# EAGLE design OSO-RING-A1-00 (EAGLE 9.6.2)
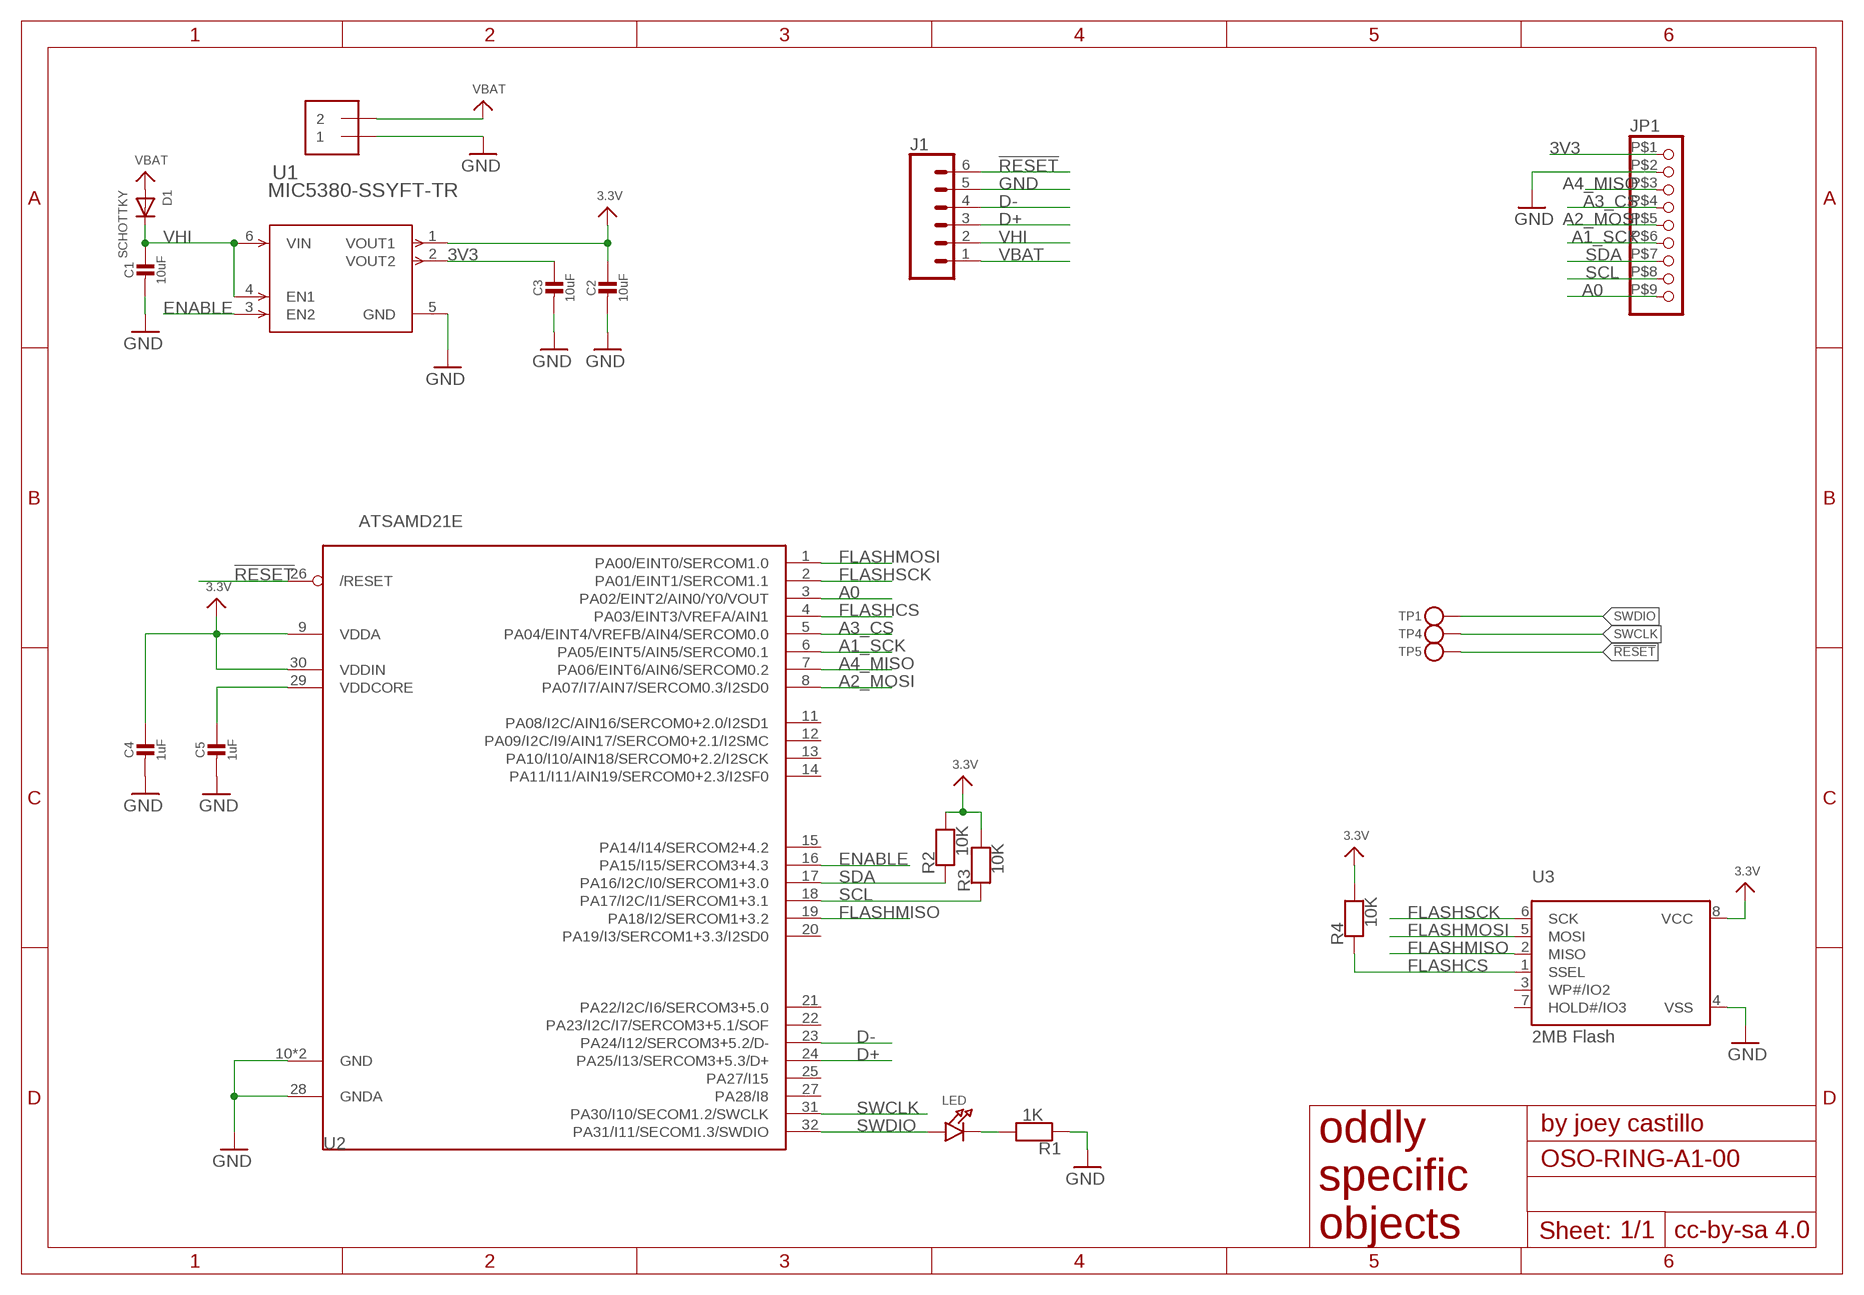
[diagram p0: schematic, sheet 1]

## Parts
C1  10uF  CAP_CERAMIC0603_NO  [0603-NO]
C2  10uF  CAP_CERAMIC0603_NO  [0603-NO]
C3  10uF  CAP_CERAMIC0603_NO  [0603-NO]
C4  1uF  CAP_CERAMIC0603_NO  [0603-NO]
C5  1uF  CAP_CERAMIC0603_NO  [0603-NO]
D1  SCHOTTKY  DIODESOD-123  [SOD-123]
J1  CONN_06SMD-1MM  [1X06-1MM]
J2  1X2SMT  [2PIN_SMT_CONNECTOR]
JP1  HEADER-1X9BOARD_TO_FLEX  [9PIN_SMT_CONNECTOR]
LED  LED0603_NOOUTLINE  [CHIPLED_0603_NOOUTLINE]
R1  1K  RESISTOR_0603_NOOUT  [0603-NO]
R2  10K  RESISTOR_0603_NOOUT  [0603-NO]
R3  10K  RESISTOR_0603_NOOUT  [0603-NO]
R4  10K  RESISTOR_0603_NOOUT  [0603-NO]
TP1  TESTPOINTROUND1.5MMNO  [TESTPOINT_ROUND_1.5MM_NO]
TP4  TESTPOINTROUND1.5MMNO  [TESTPOINT_ROUND_1.5MM_NO]
TP5  TESTPOINTROUND1.5MMNO  [TESTPOINT_ROUND_1.5MM_NO]
U1  MIC5380-SSYFT-TR  [TMLF-6_FT_MCH]
U2  ATSAMD21E  [QFN32_5MM]
U3  2MB Flash  SPIFLASH_8PINUX  [USON8]

## Nets
3.3V: C2.1 C4.1 R2.2 R3.2 R4.2 U1.1(VOUT1) U2.9(VDDA) U2.30(VDDIN) U3.8(VCC)
3V3: C3.1 JP1.P$1 U1.2(VOUT2)
!RESET: J1.6 TP5.P$1 U2.26(/RESET)
A0: JP1.P$9 U2.3(PA02/EINT2/AIN0/Y0/VOUT)
A1_SCK: JP1.P$6 U2.6(PA05/EINT5/AIN5/SERCOM0.1)
A2_MOSI: JP1.P$5 U2.8(PA07/I7/AIN7/SERCOM0.3/I2SD0)
A3_CS: JP1.P$4 U2.5(PA04/EINT4/VREFB/AIN4/SERCOM0.0)
A4_MISO: JP1.P$3 U2.7(PA06/EINT6/AIN6/SERCOM0.2)
D+: J1.3 U2.24(PA25/I13/SERCOM3+5.3/D+)
D-: J1.4 U2.23(PA24/I12/SERCOM3+5.2/D-)
ENABLE: U1.3(EN2) U2.16(PA15/I15/SERCOM3+4.3)
FLASHCS: R4.1 U2.4(PA03/EINT3/VREFA/AIN1) U3.1(SSEL)
FLASHMISO: U2.19(PA18/I2/SERCOM1+3.2) U3.2(MISO)
FLASHMOSI: U2.1(PA00/EINT0/SERCOM1.0) U3.5(MOSI)
FLASHSCK: U2.2(PA01/EINT1/SERCOM1.1) U3.6(SCK)
GND: C1.2 C2.2 C3.2 C4.2 C5.2 J1.5 J2.P$1 JP1.P$2 R1.1 U1.5(GND) U2.10(GND) U2.28(GNDA) U2.33(GND) U3.4(VSS)
N$1: LED.C R1.2
SCL: JP1.P$8 R3.1 U2.18(PA17/I2C/I1/SERCOM1+3.1)
SDA: JP1.P$7 R2.1 U2.17(PA16/I2C/I0/SERCOM1+3.0)
SWCLK: TP4.P$1 U2.31(PA30/I10/SECOM1.2/SWCLK)
SWDIO: LED.A TP1.P$1 U2.32(PA31/I11/SECOM1.3/SWDIO)
VBAT: D1.A J1.1 J2.P$2
VDDCORE: C5.1 U2.29(VDDCORE)
VHI: C1.1 D1.C J1.2 U1.4(EN1) U1.6(VIN)
Unconnected: U2.11(PA08/I2C/AIN16/SERCOM0+2.0/I2SD1) U2.12(PA09/I2C/I9/AIN17/SERCOM0+2.1/I2SMC) U2.13(PA10/I10/AIN18/SERCOM0+2.2/I2SCK) U2.14(PA11/I11/AIN19/SERCOM0+2.3/I2SF0) U2.15(PA14/I14/SERCOM2+4.2) U2.20(PA19/I3/SERCOM1+3.3/I2SD0) U2.21(PA22/I2C/I6/SERCOM3+5.0) U2.22(PA23/I2C/I7/SERCOM3+5.1/SOF) U2.25(PA27/I15) U2.27(PA28/I8) U3.3(WP#/IO2) U3.7(HOLD#/IO3)

## Library data of the parts
C1-C5 = microbuilder:CAP_CERAMIC: Ceramic Capacitors For new designs, use the packages preceded by an '_' character since they are more reliable: The following footprints should be used on most boards: _0402 - Standard footprint for regular board layouts _0603 - Standard footprint for regular board layouts _0805 - Standard footprint for regular board layouts _1206 - Standard footprint for regular board layouts For extremely tight-pitch boards where space is at a premium, the following 'micro-pitch' footprints can be used (smaller pads, no silkscreen outline, etc.): _0402MP - Micro-pitch footprint for very dense/compact boards _0603MP - Micro-pitch footprint for very dense/compact boards _0805MP - Micro-pitch footprint for very dense/compact boards _1206MP - Micro-pitch footprint for very dense/compact boards
D1 = adafruit:DIODE: Diode SMADIODE - SMA Surface Mount Package 20V 1A Schottky Diode Digikey: 641-1014-6-ND DO-1N4148 - Through Hole Small Current Diode SOD-123 20V 1 A (.5mV Vf) Schottky Diode - Digikey: MBRX120TPMSCT-ND SOD-323 10V 570mA (.38mV Vf, 3ns) Schottky Diode - Digikey: ZLLS410CT-ND SOD-523 30V 30mA Schottky Diode (RB751S-40TE61) - Digikey: RB751S-40TE61CT-ND SOT23-R/W - SOT23 Package (R = Solder Paste/Reflow Ovens, W = Hand-Soldering) BAT54Film 40V 300mA - Digikey: 497-7162-1-ND
J1 = SparkFun-Connectors:CONN_06: Multi connection point. Often used as Generic Header-pin footprint for 0.1 inch spaced/style header connections On any of the 0.1 inch spaced packages, you can populate with these: Break Away Headers - Straight <https://www.sparkfun.com/products/116> (PRT-00116) Break Away Male Headers - Right Angle <https://www.sparkfun.com/products/553> (PRT-00553) Female Headers <https://www.sparkfun.com/products/115> (PRT-00115) Break Away Headers - Machine Pin <https://www.sparkfun.com/products/117> (PRT-00117) Break Away Female Headers - Swiss Machine Pin <https://www.sparkfun.com/products/743> (PRT-00743) Arduino Stackable Header - 6 Pin <https://www.sparkfun.com/products/9280> (PRT-09280) For SCREWTERMINALS and SPRING TERMINALS visit here: Screw Terimnals on SparkFun.com <https://www.sparkfun.com/search/results?term=Screw+Terminals> (5mm/3.5mm/2.54mm spacing) This device is also useful as a general connection point to wire up your design to another part of your project. Our various solder wires solder well into these plated through hole pads. Hook-Up Wire - Assortment (Stranded, 22 AWG) <https://www.sparkfun.com/products/11375> (PRT-11375) Hook-Up Wire - Assortment (Solid Core, 22 AWG) <https://www.sparkfun.com/products/11367> (PRT-11367) View the entire wire category on our website here <https://www.sparkfun.com/categories/141>; PROD_ID: CONN-08249; SF_ID: GPS-00579
J2 = My Stuff:1X2: 3.5mm Terminal block http://www.ladyada.net/library/pcb/eaglelibrary.html
JP1 = My Stuff:HEADER-1X9: PIN HEADER
LED = My Stuff:LED: LED 0603 - 0603 Surface Mount Package 2mA: Green LED - Low Power (3.9mcd, 2ma, 1.7Vf) - Digikey: 475-2709-2-ND Orange LED - Low Power (9.8mcd, 2ma, 1.8Vf) - Digikey: 475-1194-2-ND Red LED - Low Power (5mcd, 2ma, 1.8Vf) - Digikey: 475-1195-2-ND Yellow LED - Low Power (7mcd, 2ma, 1.8Vf) - Digikey: 475-1196-2-ND 5mA: Blue LED - Low Power (17mcd, 5ma, 2.9Vf) - Digikey: LNJ937W8CRACT-ND 0805 - 0805 Surface Mount Package 2mA: Red LED (8.8mcd, 2mA, 1.8Vf, Clear) - Low Power [Digikey: 475-2510-1-ND] Green LED (5mcd, 2mA, 1.8Vf, Clear) - Low Power [Digikey: 475-2730-1-ND] Yellow LED (11.3mcd, 2mA, 1.8Vf, Clear) - Low Power [Digikey: 475-2555-1-ND] 20mA: Red LED (104mcd, 20mA, Diffused) - LS R976 [Digikey: 475-1278-6-ND] Red LED (12mcd, 20mA, 2.0Vf, Clear) - APT2012EC [Digikey: 754-1128-1-ND] Green LED (15mcd, 20mA, 2.2Vf, Clear) - APT2012GC [Digikey: 754-1131-1-ND] Orange LED (160mcd, 20mA, 2.1Vf, Clear) - APT2012SECK [Digikey: 754-1130-1-ND] 1206 - 1206 Surface Mount Package Green LED (26mcd, 20mA, Diffused) - LG N971 [Digikey: 475-1407-6-ND] Red LED (15mcd, 20mA, Diffused) - LH N974 [Digikey: 475-1416-6-ND] Cree - Cree High-Power Surface Mount LEDs XPEBWT-L1-0000-00D50 - White 111lm 350mA 2.9Vf 6200K 110° XTEAWT-00-0000-00000LEE3 - White 114lm 350mA 2.85Vf 5000K 115° Everlight - Everlight 45-21 Series Surface Mount LEDs 45-21/QK2C-B2832AC2CB2/2T - Warm White 2000mcd 20mA 3.25Vf 3050K 120° 45-21/LK2C-B38452C4CB2/2T - Nuetral White 2000mcd 20mA 3.25Vf 4150K 120° 45-21/LK2C-B50634C6CB2/2T - Cold White 2200mcd 20mA 3.25Vf 5650K 120° PLCC2 Reverse Mount LS T77K-J1L2-1-0-2-R18-Z - Red 11.25mcd 2mA 1.8Vf 630nm 120° LO T77K-L1M2-24-Z - Orange 19.6mcd 2mA 1.8Vf 606nm 120° LY T77K-K2M1-26-Z - Yellow 15.7mcd 2mA 1.8Vf 587nm 120°
R1-R4 = microbuilder:RESISTOR: Resistors For new designs, use the packages preceded by an '_' character since they are more reliable: The following footprints should be used on most boards: _0402 - Standard footprint for regular board layouts _0603 - Standard footprint for regular board layouts _0805 - Standard footprint for regular board layouts _1206 - Standard footprint for regular board layouts For extremely tight-pitch boards where space is at a premium, the following 'micro-pitch' footprints can be used (smaller pads, no silkscreen outline, etc.): _0402MP - Micro-pitch footprint for very dense/compact boards _0603MP - Micro-pitch footprint for very dense/compact boards _0805MP - Micro-pitch footprint for very dense/compact boards _1206MP - Micro-pitch footprint for very dense/compact boards
TP1 TP4 TP5 = microbuilder:TESTPOINT: Test Point Various test points for characterisation and PCB testing TESTPOINT_SMT - Compact Surface Mount Test Point [Digikey: 5016KTR-ND]
U1 = MIC5380SSYFTTR:MIC5380-SSYFT-TR; BUILT_BY: EMA_Jessica; COPYRIGHT: Copyright (C) 2018 Accelerated Designs. All rights reserved; MANUFACTURER_PART_NUMBER: MIC5380-SSYFT-TR; SOURCELIBRARY: Microchip_2019-08-23_3; VENDOR: Microchip
U2 = microbuilder:ATSAMD21E
U3 = microbuilder:SPIFLASH_8PIN: SOIC8 SPI Flash Be careful with the size since SOIC8 flash comes in several 'widths' SOIC8 150 mil M25P16 - 16Mbit (2Mbit x 8) Serial Flash (75MHz SPI Bus), Supply: 2.7-3.6V Digikey: SOIC8 - M25P16-VMN6P-ND SOIC8 208 mil W25Q16BVSSIG - 16Mbit (2Mbit x 8) Serial Flash (104MHz SPI Bus), Supply: 2.7-3.6V Digikey: SOIC8 - W25Q16BVSSIG-ND

## Net classes
1 power: width 0.305 mm

## Board
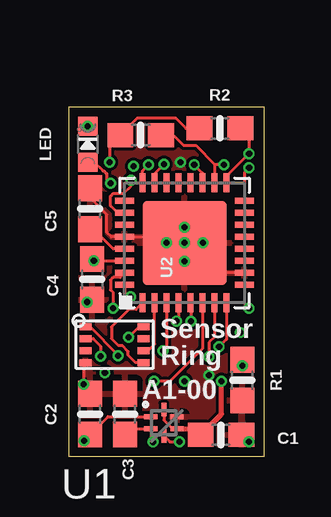
[diagram p1: board, top side]
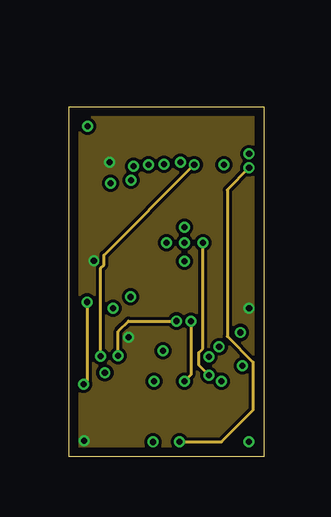
[diagram p2: board, inner layer Route2]
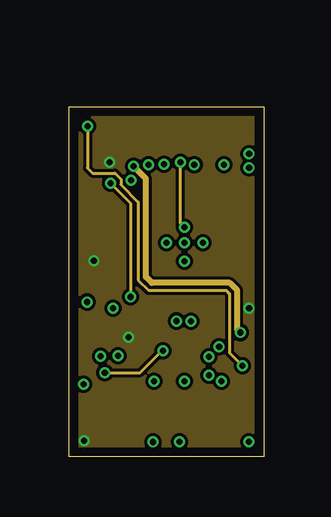
[diagram p3: board, inner layer Route15]
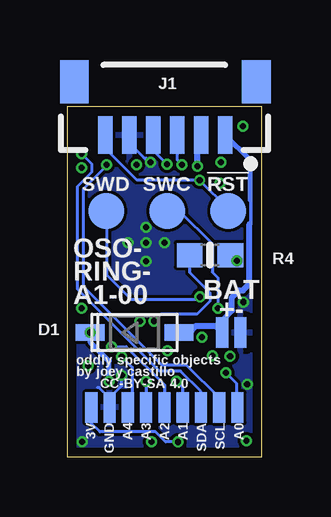
[diagram p4: board, bottom side, seen from below]

Size 8.13 x 14.58 mm. Coordinates in mm from the lower left corner, seen from the top.
Outline: 8.13,14.58 8.13,0 0,0 0,14.58 8.13,14.58
Copper layers (1*2*15*16): Top 0.035559375mm / dielectric 0.17018125mm / Route2 0.01778125mm / dielectric 47mil / Route15 0.01778125mm / dielectric 0.17018125mm / Bottom 0.035559375mm
Design rules "oshpark-4layer *": minimum track width 5mil, minimum drill 10mil, track to track 5mil, track to pad 5mil, pad to pad 5mil, via to via 5mil, smd to smd 5mil, copper to edge 15mil, drill to drill 6mil, minimum pad ring 4mil, minimum via ring 4mil, stop-mask expansion 1.5mil, vias tented up to drill 10mil, thermal gap 10mil

### Footprints (pad centres in the part's own frame; a part is rotated, then mirrored left to right if it is on the bottom)
0603-NO = smd 1.075 x 1: 1 -0.85,0; 2 0.85,0
SOD-123 = smd 1.2 x 0.7: A 1.85,0; C -1.85,0
1X06-1MM = smd 0.6 x 1.55: 1 -2.54,1.27; 2 -1.54,1.27; 3 -0.54,1.27; 4 0.46,1.27; 5 1.46,1.27; 6 2.46,1.27 | smd 1.2 x 1.8: P$1 -3.84,-0.955; P$2 3.76,-0.955
2PIN_SMT_CONNECTOR = smd 0.508 x 1.27: P$1 -0.381,0; P$2 0.381,0
9PIN_SMT_CONNECTOR = smd 0.508 x 1.27: P$1 -3.048,0; P$2 -2.286,0; P$3 -1.524,0; P$4 -0.762,0; P$5 0,0; P$6 0.762,0; P$7 1.524,0; P$8 2.286,0; P$9 3.048,0
CHIPLED_0603_NOOUTLINE = smd 0.8 x 0.8: A 0,-0.75; C 0,0.75
TESTPOINT_ROUND_1.5MM_NO = smd 1.5 x 1.5: P$1 0,0
TMLF-6_FT_MCH = smd 0.559 x 0.203: 1 -0.546,0.25; 2 -0.546,-0.25; 4 0.546,-0.25; 5 0.546,0.25 | smd 0.203 x 0.559: 3 0,-0.546; 6 0,0.546
QFN32_5MM = smd 0.8 x 0.25: 1 -2.5,1.75; 2 -2.5,1.25; 3 -2.5,0.75; 4 -2.5,0.25; 5 -2.5,-0.25; 6 -2.5,-0.75; 7 -2.5,-1.25; 8 -2.5,-1.75; 17 2.5,-1.75; 18 2.5,-1.25; 19 2.5,-0.75; 20 2.5,-0.25; 21 2.5,0.25; 22 2.5,0.75; 23 2.5,1.25; 24 2.5,1.75 | smd 0.25 x 0.8: 9 -1.75,-2.5; 10 -1.25,-2.5; 11 -0.75,-2.5; 12 -0.25,-2.5; 13 0.25,-2.5; 14 0.75,-2.5; 15 1.25,-2.5; 16 1.75,-2.5; 25 1.75,2.5; 26 1.25,2.5; 27 0.75,2.5; 28 0.25,2.5; 29 -0.25,2.5; 30 -0.75,2.5; 31 -1.25,2.5; 32 -1.75,2.5 | smd 3.5 x 3.5: 33 0,0
USON8 = smd 0.5 x 0.275: 1 -1.2,0.75; 2 -1.2,0.25; 3 -1.2,-0.25; 4 -1.2,-0.75; 5 1.2,-0.75; 6 1.2,-0.25; 7 1.2,0.25; 8 1.2,0.75

### Placement (x,y rotation side)
C1  6.35,0.91 0 top
C2  0.89,1.78 90 top
C3  2.34,1.78 90 top
C4  0.97,7.39 270 top
C5  0.89,10.34 90 top
D1  5.31,5.18 0 bottom
J1  4.06,14.68 180 bottom
J2  1.27,5.18 180 bottom
JP1  4.06,2.06 0 bottom
LED  0.79,13.03 0 top
R1  7.24,3.2 90 top
R2  6.3,13.69 180 top
R3  3,13.41 180 top
R4  2.16,8.41 0 bottom
TP1  6.48,10.24 180 bottom
TP4  3.94,10.24 180 bottom
TP5  1.4,10.24 180 bottom
U1  3.96,1.42 0 top
U2  4.83,8.92 90 top
U3  1.91,4.67 0 top

### Tracks (layer width: path | path; a pad name or v marks a point on that pad's centre or on a via)
3.3V  (via drill 0.25)
  Top 0.127: U2.30 v1.04,8.17 C4.1 | v2.49,4.98 2.93,5.42 U3.8 | v0.64,0.67 1.63,1.67 U1.1 | R2.2 4.88,13.69 4.46,14.1 2.84,14.1 R3.2 1.7,12.97 v1.7,12.27 | U2.9 7.33,6.39 v7.52,6.2
  Top 0.152: C2.1 v0.64,0.67
  Bottom 0.127: v1.04,8.17 1.07,8.17 R4.2
  pour Route15: -0.25,14.58 8.13,14.58 8.13,0.1 -0.25,0.1
  pour Route2: 0,14.58 8.13,14.58 8.13,0.1 0,0.1
3V3  (via drill 0.25)
  Top 0.127: C3.1 2.58,1.17 U1.2 3.42,0.71 v3.5,0.62
  Bottom 0.127: v3.5,0.62 4.01,0.62 4.43,1.04 6.75,1.04 7.11,1.41 JP1.P$1
!RESET  (via drill 0.25)
  Top 0.127: U2.26 2.03,10.17 1.73,10.46 1.73,10.87 1.85,10.98 2.29,10.98 2.59,11.29 v2.59,11.53
  Bottom 0.127: J1.6 6.52,12.85 5.21,11.53 v2.59,11.53 1.4,10.34 TP5.P$1
A0  (via drill 0.25)
  Top 0.127: U2.3 4.08,4.56 v3.93,4.42
  Route15 0.127: v1.5,3.51 2.97,3.51 3.88,4.42 v3.93,4.42
  Bottom 0.127: JP1.P$9 1.07,2.11 1.07,3.08 v1.5,3.51
A1_SCK  (via drill 0.25)
  Top 0.127: U2.6 5.58,4.51 4.22,3.15 v3.56,3.15
  Bottom 0.127: v3.56,3.15 3.3,2.9 JP1.P$6
A2_MOSI  (via drill 0.25)
  Top 0.127: U2.8 6.58,4.9 v6.27,4.59
  Bottom 0.127: v6.27,4.59 5.66,4.59 4.06,3 JP1.P$5
A3_CS  (via drill 0.25)
  Top 0.127: U2.5 5.09,6.4 v5.09,5.66
  Route2 0.127: v5.09,5.66 5.09,3.41 v4.83,3.15
  Bottom 0.127: v4.83,3.15 JP1.P$4
A4_MISO  (via drill 0.25)
  Top 0.127: U2.7 6.08,4.99 5.85,4.77 v5.85,4.18 v5.84,4.17
  Bottom 0.127: v5.84,4.17 5.41,3.74 5.41,2.24 JP1.P$3
D+  (via drill 0.25)
  Top 0.127: U2.24 3.08,11.92 v3.33,12.17
  Bottom 0.127: v3.33,12.17 3.52,12.36 J1.3
D-  (via drill 0.25)
  Top 0.127: U2.23 3.58,11.81 v3.96,12.19
  Bottom 0.127: v3.96,12.19 4.52,12.75 J1.4
ENABLE  (via drill 0.25)
  Top 0.127: U1.3 4.21,0.62 v4.61,0.62 | v7.52,12.04 7.33,11.85 U2.16
  Route2 0.127: v4.61,0.62 6.36,0.62 7.68,1.94 7.68,3.94 6.6,5.02 6.6,11.13 v7.52,12.04
FLASHCS  (via drill 0.25)
  Top 0.127: U2.4 4.58,5.74 v4.5,5.66 | U3.1 0.88,5.42 2.06,4.24 v2.06,4.22
  Route2 0.127: v2.06,4.22 2.06,5.23 2.49,5.66 v4.5,5.66
  Bottom 0.127: R4.1 3.01,7.69 2.16,6.84 2.16,6.49 2.71,5.94 4.21,5.94 v4.5,5.66
FLASHMISO  (via drill 0.25)
  Top 0.127: U3.2 1.01,4.92 1.32,4.61 v1.32,4.19 | v5.23,12.17 5.58,11.82 U2.19
  Route2 0.127: v1.32,4.19 1.32,7.85 1.46,7.99 1.46,8.4 v5.23,12.17
FLASHMOSI
  Top 0.127: U3.5 2.78,3.92 2.48,4.23 2.48,4.39 2.23,4.64 2.07,4.64 1.78,4.93 1.78,5.42 2.5,6.14 2.8,6.14 U2.1
FLASHSCK
  Top 0.127: U3.6 3.31,4.42 3.58,4.69 U2.2
GND  (via drill 0.25)
  Top 0.127: C5.2 0.89,10.79 1.58,10.1 1.58,9.36 1.78,9.17 U2.28 3.81,9.17 v4.06,8.92 | U2.10 6.41,7.67 5.59,8.48 v5.59,8.92 | C2.2 0.61,2.91 v0.61,3.02 0.61,3.83 U3.4 | C1.2 7.22,0.91 v7.5,0.64
  Route2 0.127: v0.76,6.45 0.76,3.17 v0.61,3.02 | v5.59,8.92 5.59,4.51 5.42,4.35 5.42,3.82 v5.84,3.4
  Route15 0.127: v4.83,9.58 4.65,9.75 v4.65,12.28
  Bottom 0.127: 6.35,2.45 5.84,2.96 v5.84,3.4 | 6.86,2.9 6.85,2.88 6.78,2.88 6.35,2.45 | JP1.P$2 6.35,2.45 | v4.65,12.28 4.81,12.45 4.9,12.45 5.52,13.07 J1.5
  other vias: 4.83,8.92 4.83,8.15
  pour Top: -0.25,14.58 8.13,14.58 8.13,0.1 -0.25,0.1
  pour Bottom: -0.25,14.58 8.13,14.58 8.13,0.1 -0.25,0.1
N$1  (via drill 0.25)
  Top 0.127: R1.2 v7.24,3.8
  Route15 0.127: LED.C 0.77,13.77 0.77,12.05 0.76,12.04 0.98,11.82 1.92,11.82 2.17,11.57 2.17,11.34 2.89,10.62 2.89,7.37 3.33,6.93 6.58,6.93 6.71,6.8 6.71,4.33 v7.24,3.8
  other vias: 0.79,13.78
SCL  (via drill 0.25)
  Top 0.127: R3.1 4.36,13.41 4.79,12.98 5.29,12.98 6.1,12.17 | U2.18 6.08,12.17 6.1,12.17 | v6.47,12.17 6.1,12.17
  Bottom 0.127: JP1.P$8 1.78,2.45 3.15,3.82 4.17,3.82 7.43,7.08 7.43,11.18 6.47,12.14 v6.47,12.17
SDA  (via drill 0.25)
  Top 0.127: U2.17 6.58,11.69 v7.51,12.62 v7.52,12.62 7.52,13.32 R2.1
  Bottom 0.127: JP1.P$7 2.54,2.73 3.38,3.57 4.28,3.57 7.68,6.98 7.68,11.28 7.53,11.44 7.1,11.87 7.1,12.21 v7.51,12.62 v7.52,12.62
SWCLK  (via drill 0.25)
  Top 0.127: U2.31 2.14,7.48 1.85,7.48 1.73,7.37 1.73,6.96 1.84,6.86 v1.84,6.2
  Bottom 0.127: TP4.P$1 3.43,10.24 2.06,8.87 2.06,7.7 1.84,7.47 v1.84,6.2
SWDIO  (via drill 0.25)
  Top 0.127: U2.32 2.33,6.66 v2.58,6.66 | v1.75,11.4 1.58,11.57 1.58,11.8 1.47,11.92 1.42,11.92 1.06,12.28 LED.A
  Route15 0.127: v1.75,11.4 2.58,10.57 v2.58,6.66
  Bottom 0.127: v2.58,6.66 2.67,6.58 5.46,6.58 6.48,7.59 TP1.P$1
VBAT
  Bottom 0.127: 0.51,9.7 0.45,9.76 | 0.45,10.67 0.48,10.71
  Bottom 0.137: 0.45,10.67 0.45,9.76
  Bottom 0.203: J1.1 0.48,12.37 0.48,10.71
  Bottom 0.254: D1.A 3.03,5.18 2.75,5.46 1.93,5.46 J2.P$2 1.65,5.7 1.25,6.11 1.25,6.65 0.96,6.93 0.79,6.93 0.51,7.21 0.51,9.7
VDDCORE
  Top 0.127: C5.1 1.03,9.49 1.85,8.67 U2.29
VHI  (via drill 0.25)
  Top 0.127: U1.6 3.96,1.53 4.32,1.17 U1.4
  Top 0.203: U1.4 5.24,1.17 C1.1 6.37,1.79 v6.37,3.15
  Route15 0.254: D1.C 7.02,5.32 7.02,6.93 6.71,7.25 3.46,7.25 3.21,7.5 3.21,11.59 v2.69,12.11 v2.69,12.12
  Bottom 0.203: v6.37,3.15 6.37,3.99 7.16,4.78 D1.C
  Bottom 0.254: v2.69,12.12 2.69,13.24 J1.2
  other vias: 7.16,5.18

### Text on the board
tPlace: Sensor / Ring | A1-00
bPlace: !RST | SWC | SWD | OSO- / RING- / A1-00 | BAT / +- | oddly specific objects / by joey castillo / CC-BY-SA 4.0 | 3V / GND / A4 / A3 / A2 / A1 / SDA / SCL / A0